# Altium schematic sheet A07_BUS_CONTROL.SchDoc: A07_BUS_CONTROL
size 420 x 296 mm; Revision: A-SCH-AD-R2-NO-TP; SheetNumber: 7; SheetTotal: 7
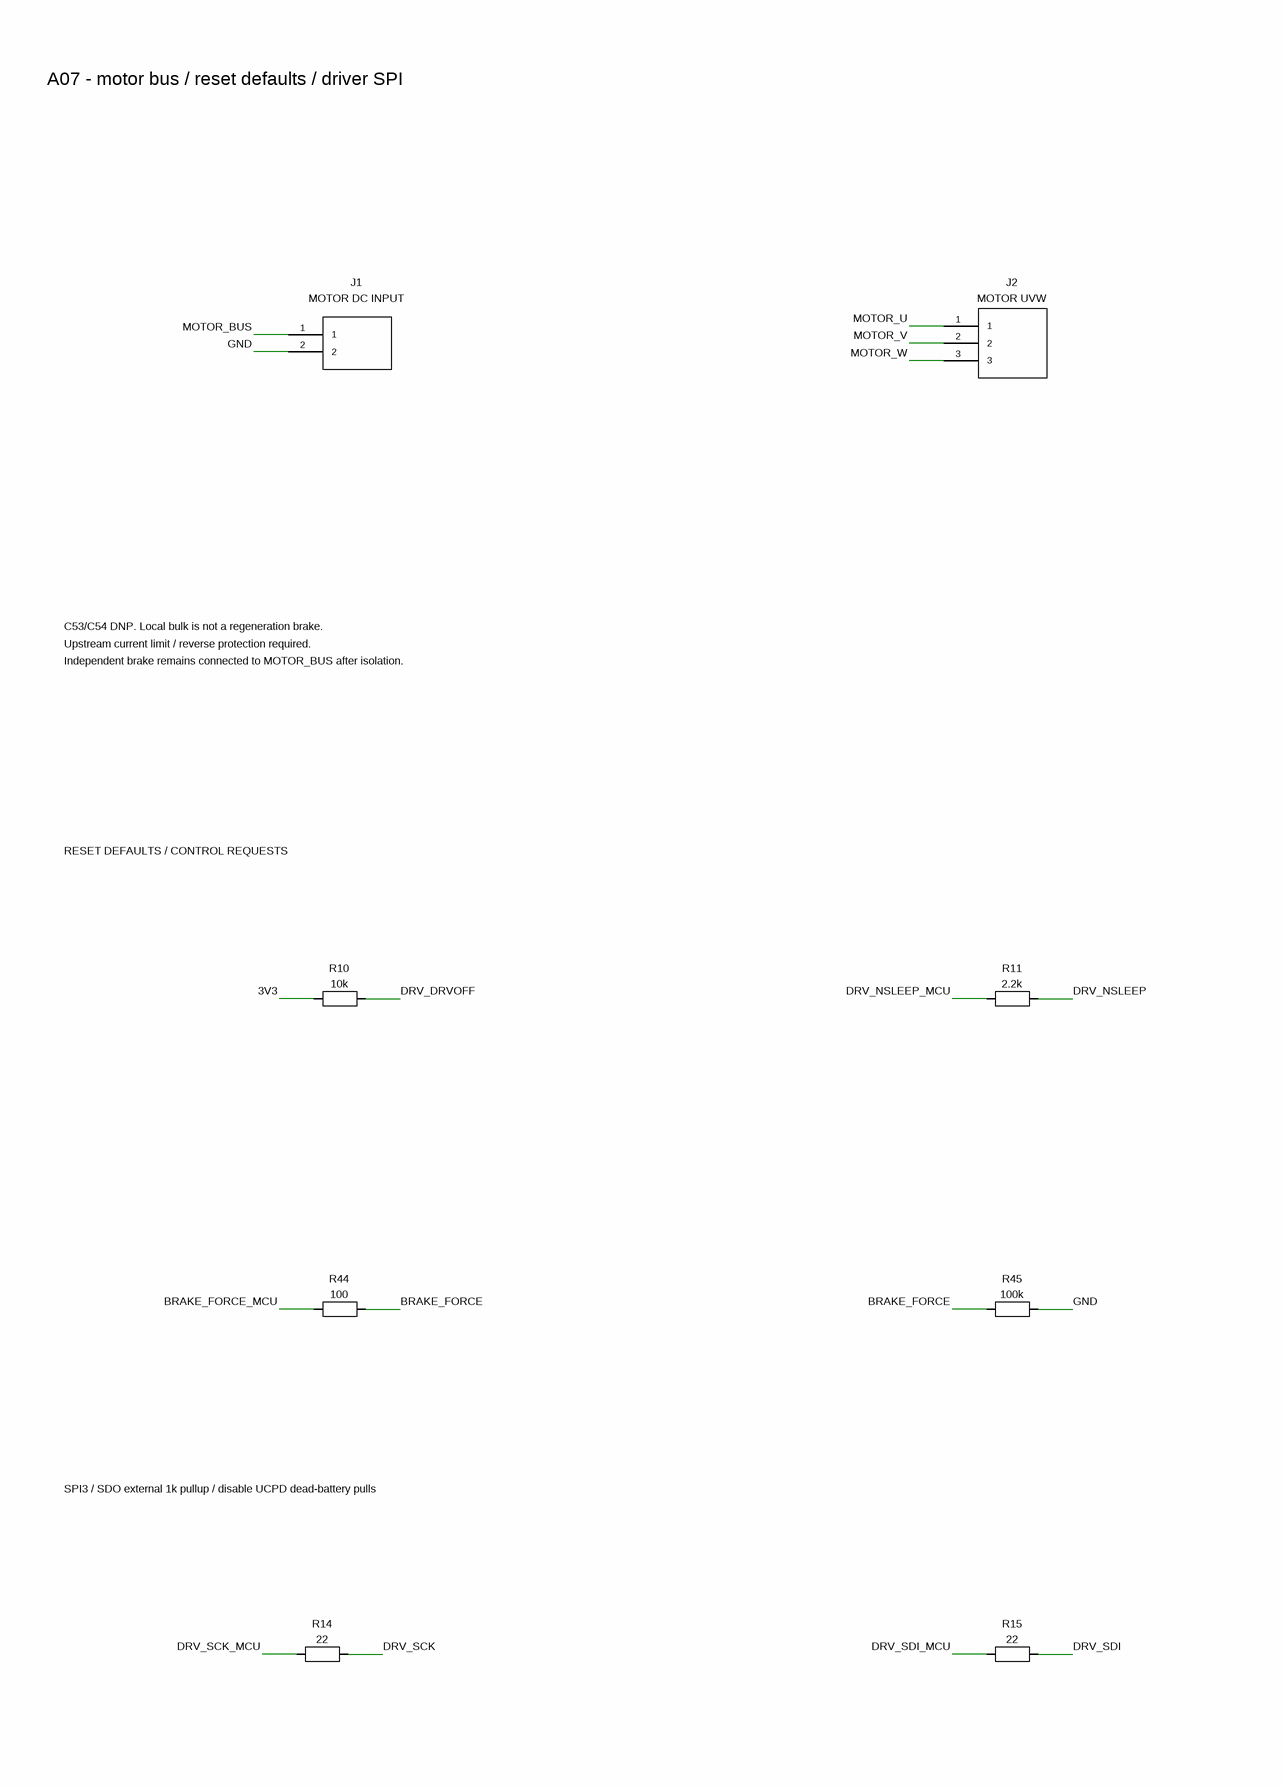
[diagram p0: A07_BUS_CONTROL.SchDoc, left]
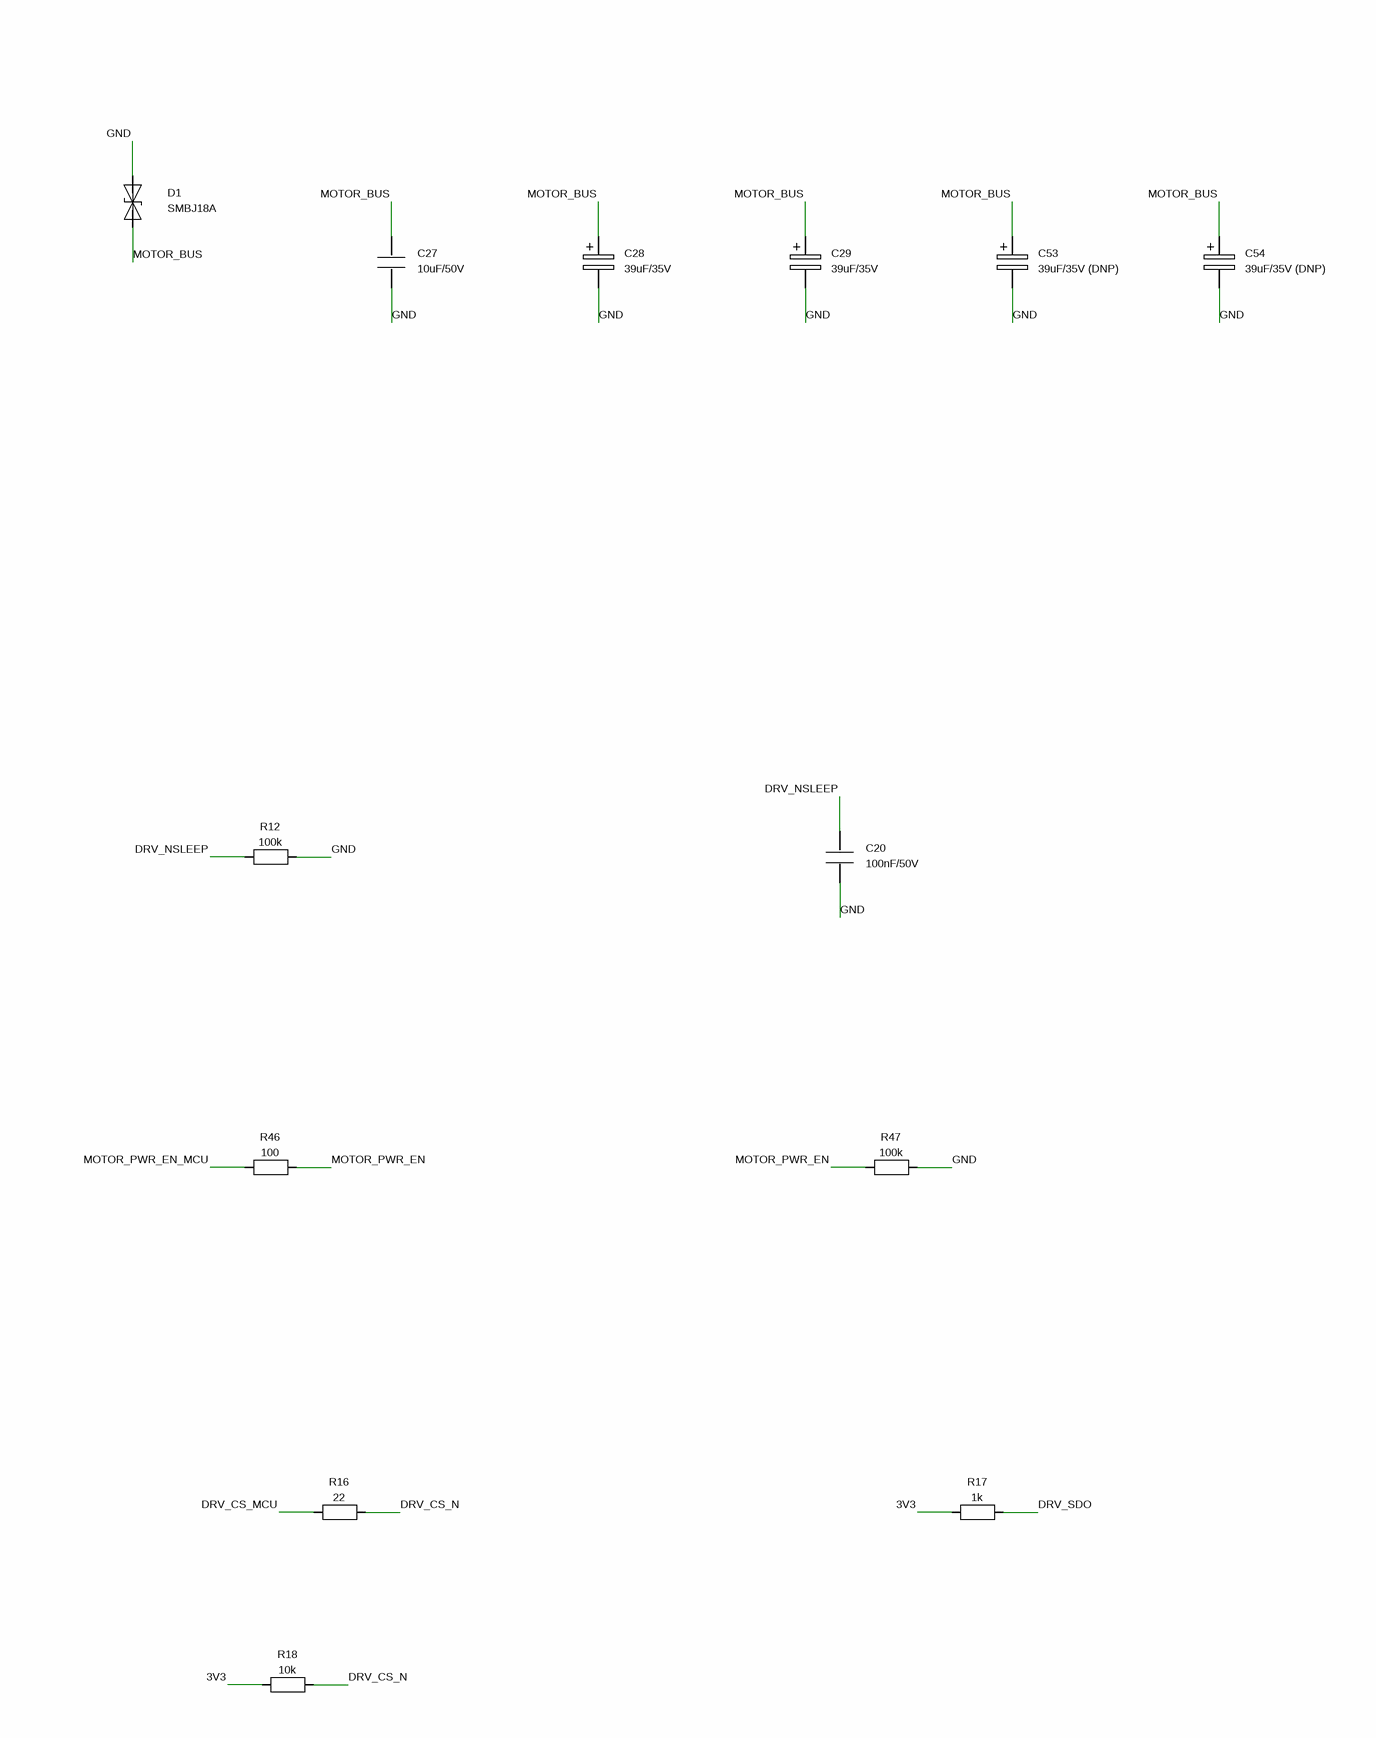
[diagram p1: A07_BUS_CONTROL.SchDoc, right]

## Parts
C20  100nF/50V  [C0603_M]
C27  10uF/50V  [CAPC3225X270N]
C28  39uF/35V  [16SVF270M]
C29  39uF/35V  [16SVF270M]
C53  39uF/35V (DNP)  [16SVF270M]
C54  39uF/35V (DNP)  [16SVF270M]
D1  SMBJ18A  [C151256_DO-214AA]
J1  MOTOR DC INPUT
J2  MOTOR UVW
R10  10k  [R0603_M]
R11  2.2k  [R0603_M]
R12  100k  [R0603_M]
R14  22  [R0603_M]
R15  22  [R0603_M]
R16  22  [R0603_M]
R17  1k  [R0603_M]
R18  10k  [R0603_M]
R44  100  [R0603_M]
R45  100k  [R0603_M]
R46  100  [R0603_M]
R47  100k  [R0603_M]

## Nets
3V3: R10.1 R17.1 R18.1
BRAKE_FORCE: R44.2 R45.1
BRAKE_FORCE_MCU: R44.1
DRV_CS_MCU: R16.1
DRV_CS_N: R16.2 R18.2
DRV_DRVOFF: R10.2
DRV_NSLEEP: C20.1 R11.2 R12.1
DRV_NSLEEP_MCU: R11.1
DRV_SCK: R14.2
DRV_SCK_MCU: R14.1
DRV_SDI: R15.2
DRV_SDI_MCU: R15.1
DRV_SDO: R17.2
GND: C20.2 C27.2 C28.2 C29.2 C53.2 C54.2 D1.2(A2) J1.2 R12.2 R45.2 R47.2
MOTOR_BUS: C27.1 C28.1 C29.1 C53.1 C54.1 D1.1(A1) J1.1
MOTOR_PWR_EN: R46.2 R47.1
MOTOR_PWR_EN_MCU: R46.1
MOTOR_U: J2.1
MOTOR_V: J2.2
MOTOR_W: J2.3

## Notes on the sheet
- A07 - motor bus / reset defaults / driver SPI
- C53/C54 DNP. Local bulk is not a regeneration brake.
- Upstream current limit / reverse protection required.
- Independent brake remains connected to MOTOR_BUS after isolation.
- RESET DEFAULTS / CONTROL REQUESTS
- SPI3 / SDO external 1k pullup / disable UCPD dead-battery pulls

## Library data of the parts
C20 = C: 电容; MPN: CL10B104KB8NNNC; Source_KiCad_Footprint: GL30:C_0603_1608Metric; Specification: 100 nF / 50 V X7R; Design_note: PA12驱动；只作开关机，快速故障复位优先CLR_FLT; Assembly: FITTED; PCB_Model_Status: USER_LIBRARY_LINKED_PIN_NUMBERS_CHECKED; Package: 0603; Footprint_status: LIBRARY_SELECTED_PENDING_LAYOUT_REVIEW; Value: 100nF/50V
C27 = C: 电容; MPN: GRM32ER71H106KA12L; Source_KiCad_Footprint: GL30:C_1210_3225Metric; Specification: 10 µF / 50 V X7R; Design_note: 陶瓷局部储能，核对直流偏压后有效容量; Assembly: FITTED; PCB_Model_Status: USER_LIBRARY_LINKED_PIN_NUMBERS_CHECKED; Package: 1210; Footprint_status: LIBRARY_SELECTED_PENDING_LAYOUT_REVIEW; Value: 10uF/50V
C28 = C_Polarized: 电容; MPN: 35SVPF39M; Specification: 39 µF / 35 V 聚合物 ±20%; Design_note: 有极性，+接VM；2颗共78µF，不承担连续再生; Assembly: FITTED; PCB_Model_Status: USER_LIBRARY_LINKED_PIN_NUMBERS_CHECKED; Package: SMD φ8 × 6.9 mm / E7; Footprint_status: PENDING_PHYSICAL_FOOTPRINT_REVIEW; Value: 39uF/35V
C29 = C_Polarized: 电容; MPN: 35SVPF39M; Specification: 39 µF / 35 V 聚合物 ±20%; Design_note: 有极性，+接VM；φ8×6.9mm需在R11内部校核; Assembly: FITTED; PCB_Model_Status: USER_LIBRARY_LINKED_PIN_NUMBERS_CHECKED; Package: SMD φ8 × 6.9 mm / E7; Footprint_status: PENDING_PHYSICAL_FOOTPRINT_REVIEW; Value: 39uF/35V
C53 C54 = C_Polarized: 电容; MPN: 35SVPF39M; Specification: 39 µF / 35 V 聚合物 ±20%; Design_note: 可选增容位置；若空间不足可不保留，不作为装机采购; Assembly: DNP_OR_DIRECT_WIRE_PADS; PCB_Model_Status: USER_LIBRARY_LINKED_PIN_NUMBERS_CHECKED; Package: SMD φ8 × 6.9 mm / E7; Footprint_status: PENDING_PHYSICAL_FOOTPRINT_REVIEW; Value: 39uF/35V
D1 = D_TVS: 母线瞬态TVS; Source_KiCad_Footprint: GL30:D_SMB; Specification: 单向；VRWM18 V; Design_note: 上游必须有限流/熔断；TVS只抑制尖峰，不能吸收连续反拖; Assembly: FITTED; PCB_Model_Status: USER_LIBRARY_LINKED_PIN_NUMBERS_CHECKED; MPN: SMBJ18A; Package: SMB / DO-214AA; Footprint_status: LIBRARY_SELECTED_PENDING_LAYOUT_REVIEW; Value: SMBJ18A
J1 = Connector_2: 电机母线焊线口; MPN: 2大焊盘+线束应力释放; Design_note: 通过短20–22AWG导线接XT30；上游B板保护与自动制动同接此母线; Assembly: DNP_OR_DIRECT_WIRE_PADS; PCB_Model_Status: NOT_ASSIGNED_IN_ALTIUM_SCHEMATIC_DELIVERY; Package: 2个焊线通孔；布局时按实线定孔径; Specification: 2大焊盘+线束应力释放; Footprint_status: PENDING_PHYSICAL_FOOTPRINT_REVIEW; Value: MOTOR DC INPUT
J2 = Connector_3: 电机三相焊线口; MPN: 3大焊盘+线束应力释放; Design_note: 沿用电机原线；三相顺序在新电机标定中确认；不重复买接插件; Assembly: DNP_OR_DIRECT_WIRE_PADS; PCB_Model_Status: NOT_ASSIGNED_IN_ALTIUM_SCHEMATIC_DELIVERY; Package: 3个焊线通孔；布局时按实线定孔径; Specification: 3大焊盘+线束应力释放; Footprint_status: PENDING_PHYSICAL_FOOTPRINT_REVIEW; Value: MOTOR UVW
R10 = R: 电阻; MPN: 通用厚膜 10k 1% 0.1 W; Source_KiCad_Footprint: GL30:R_0603_1608Metric; Specification: 10k Ω；1%；0.1 W; Design_note: 不可改100k；PA3开漏; Assembly: FITTED; PCB_Model_Status: USER_LIBRARY_LINKED_PIN_NUMBERS_CHECKED; Package: 0603; Footprint_status: LIBRARY_SELECTED_PENDING_LAYOUT_REVIEW; Value: 10k
R11 = R: 电阻; MPN: 通用厚膜 2.2k 1% 0.1 W; Source_KiCad_Footprint: GL30:R_0603_1608Metric; Specification: 2.2k Ω；1%；0.1 W; Assembly: FITTED; PCB_Model_Status: USER_LIBRARY_LINKED_PIN_NUMBERS_CHECKED; Package: 0603; Footprint_status: LIBRARY_SELECTED_PENDING_LAYOUT_REVIEW; Value: 2.2k
R12 R45 R47 = R: 电阻; MPN: 通用厚膜 100k 1% 0.1 W; Source_KiCad_Footprint: GL30:R_0603_1608Metric; Specification: 100k Ω；1%；0.1 W; Assembly: FITTED; PCB_Model_Status: USER_LIBRARY_LINKED_PIN_NUMBERS_CHECKED; Package: 0603; Footprint_status: LIBRARY_SELECTED_PENDING_LAYOUT_REVIEW; Value: 100k
R14-R16 = R: 电阻; MPN: 通用厚膜 22 1% 0.1 W; Source_KiCad_Footprint: GL30:R_0603_1608Metric; Specification: 22 Ω；1%；0.1 W; Assembly: FITTED; PCB_Model_Status: USER_LIBRARY_LINKED_PIN_NUMBERS_CHECKED; Package: 0603; Footprint_status: LIBRARY_SELECTED_PENDING_LAYOUT_REVIEW; Value: 22
R17 = R: 电阻; MPN: 通用厚膜 1k 1% 0.1 W; Source_KiCad_Footprint: GL30:R_0603_1608Metric; Specification: 1k Ω；1%；0.1 W; Design_note: TI要求SDO外部上拉；同时禁用UCPD下拉; Assembly: FITTED; PCB_Model_Status: USER_LIBRARY_LINKED_PIN_NUMBERS_CHECKED; Package: 0603; Footprint_status: LIBRARY_SELECTED_PENDING_LAYOUT_REVIEW; Value: 1k
R18 = R: 电阻; MPN: 通用厚膜 10k 1% 0.1 W; Source_KiCad_Footprint: GL30:R_0603_1608Metric; Specification: 10k Ω；1%；0.1 W; Assembly: FITTED; PCB_Model_Status: USER_LIBRARY_LINKED_PIN_NUMBERS_CHECKED; Package: 0603; Footprint_status: LIBRARY_SELECTED_PENDING_LAYOUT_REVIEW; Value: 10k
R44 R46 = R: 电阻; MPN: 通用厚膜 100 1% 0.1 W; Source_KiCad_Footprint: GL30:R_0603_1608Metric; Specification: 100 Ω；1%；0.1 W; Assembly: FITTED; PCB_Model_Status: USER_LIBRARY_LINKED_PIN_NUMBERS_CHECKED; Package: 0603; Footprint_status: LIBRARY_SELECTED_PENDING_LAYOUT_REVIEW; Value: 100